# EAGLE design mainPCB (EAGLE 8.6.0)
POPULATE: Y

## Sheet 1 of 3: RPi/ADC
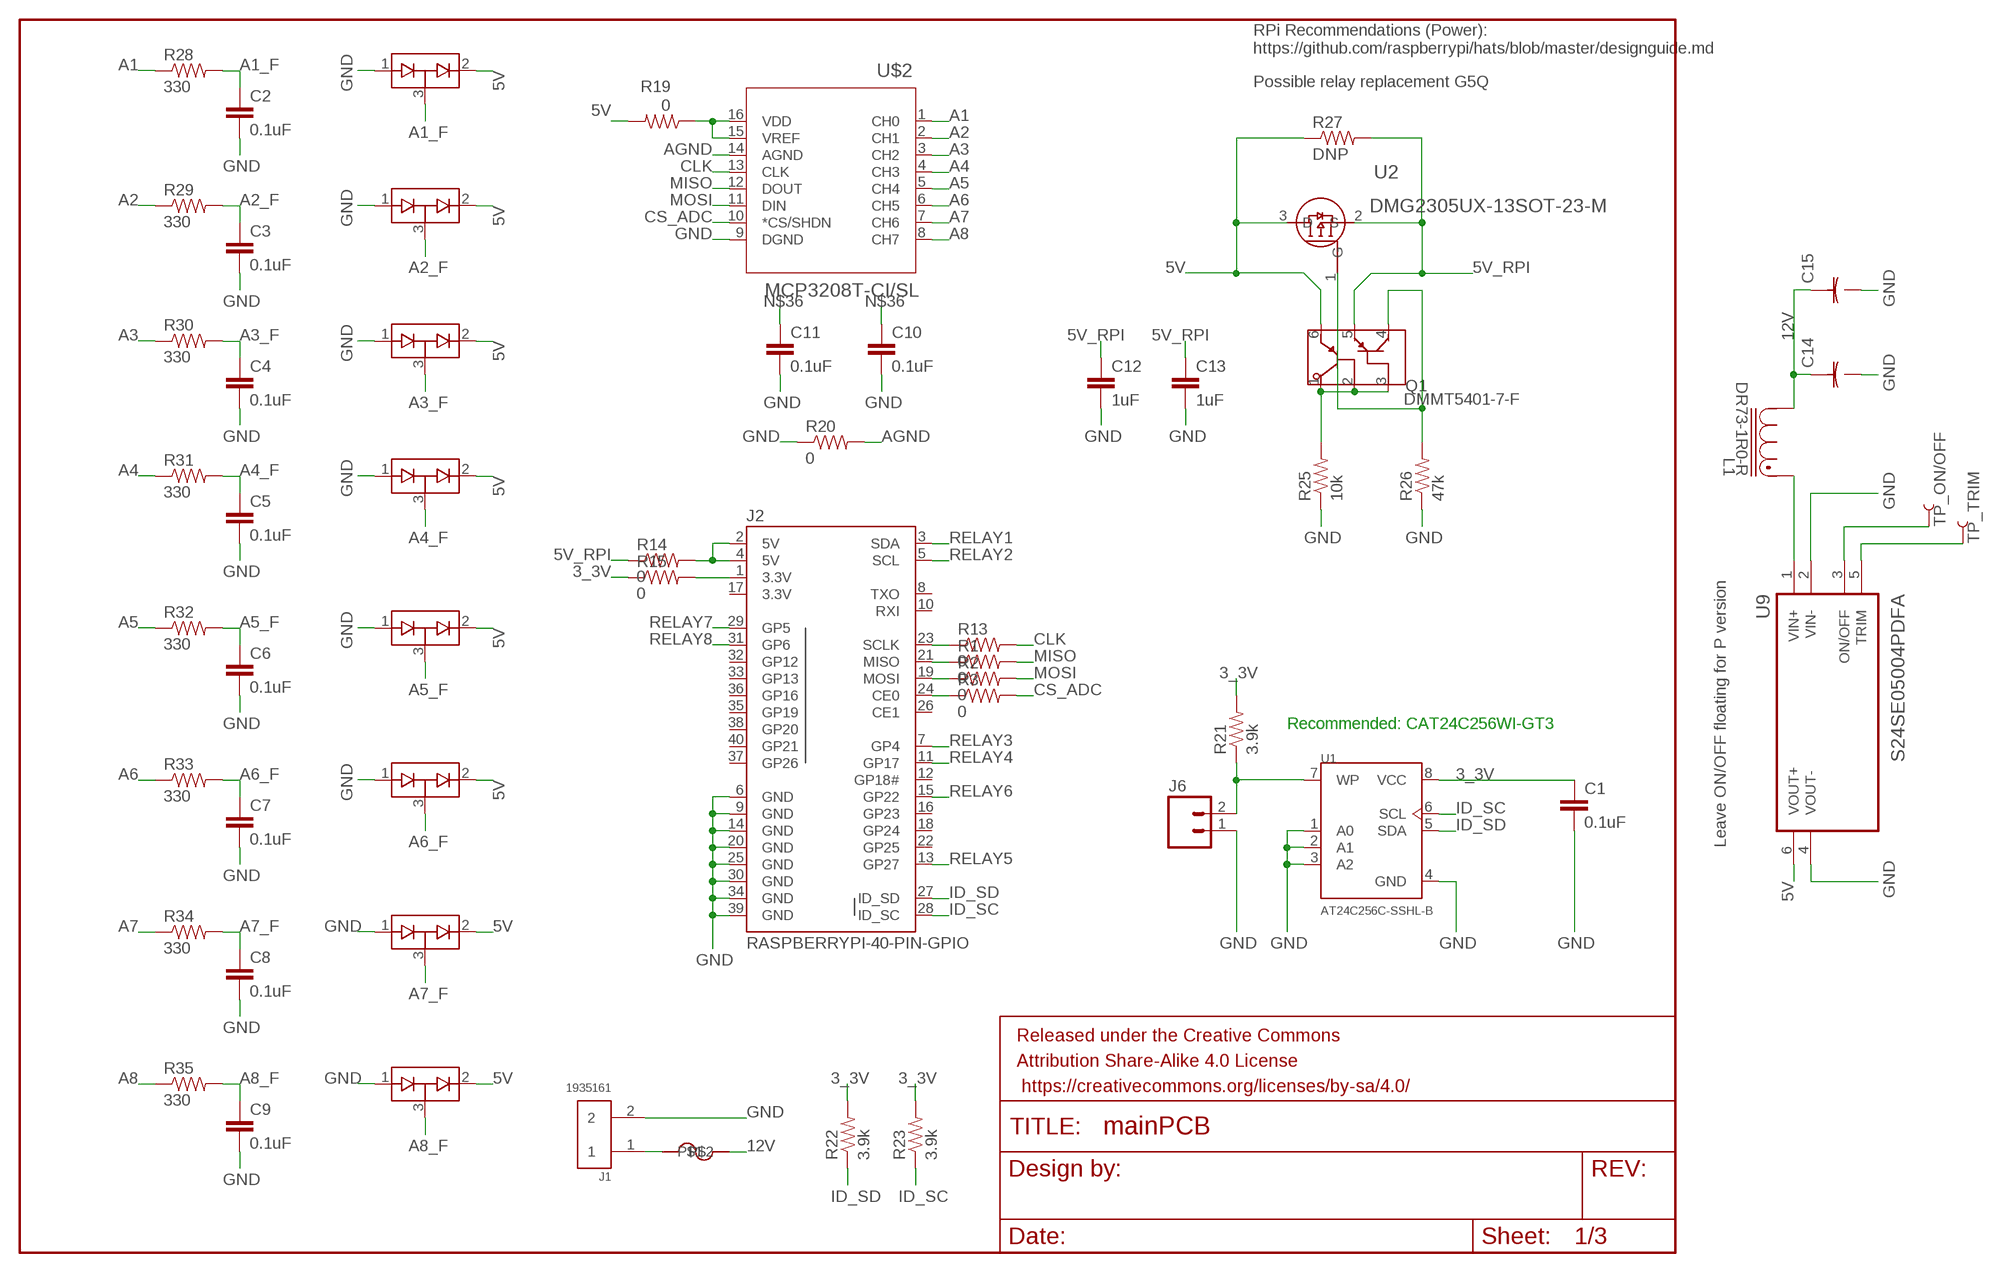
[diagram p0: schematic, sheet 1]

### Parts
C1  0.1uF  0.1UF-25V(+80/-20%)(0603)  [0603-CAP]
C2  0.1uF  0.1UF-25V(+80/-20%)(0603)  [0603-CAP]
C3  0.1uF  0.1UF-25V(+80/-20%)(0603)  [0603-CAP]
C4  0.1uF  0.1UF-25V(+80/-20%)(0603)  [0603-CAP]
C5  0.1uF  0.1UF-25V(+80/-20%)(0603)  [0603-CAP]
C6  0.1uF  0.1UF-25V(+80/-20%)(0603)  [0603-CAP]
C7  0.1uF  0.1UF-25V(+80/-20%)(0603)  [0603-CAP]
C8  0.1uF  0.1UF-25V(+80/-20%)(0603)  [0603-CAP]
C9  0.1uF  0.1UF-25V(+80/-20%)(0603)  [0603-CAP]
C10  0.1uF  0.1UF-25V(+80/-20%)(0603)  [0603-CAP]
C11  0.1uF  0.1UF-25V(+80/-20%)(0603)  [0603-CAP]
C12  1uF  1.0UF50V10%(1206)  [1206-CAP]
C13  1uF  1.0UF50V10%(1206)  [1206-CAP]
C14  EEE-HA1C471UPCAP_PAN_EEE_F-L  [CAP_PAN_EEE_F-L]
C15  EEE-HA1C471UPCAP_PAN_EEE_F-L  [CAP_PAN_EEE_F-L]
D1  BAV99-7-F  BAV99  [SOT23-3]
D5  BAV99-7-F  BAV99  [SOT23-3]
D7  BAV99-7-F  BAV99  [SOT23-3]
D12  BAV99-7-F  BAV99  [SOT23-3]
D13  BAV99-7-F  BAV99  [SOT23-3]
D14  BAV99-7-F  BAV99  [SOT23-3]
D15  BAV99-7-F  BAV99  [SOT23-3]
D16  BAV99-7-F  BAV99  [SOT23-3]
F9  3544-2  [3544-2]
FRAME2  FRAME-LETTERNO_PACKAGE  [DUMMY]
J1  1935161  [PHOENIX_1935161]
J2  RASPBERRYPI-40-PIN-GPIO  [2X20-SHROUDED]
J6  M02PTH  [1X02]
L1  DR73-1R0-R  [DR73]
Q1  DMMT5401-7-F  [SOT26]
R1  0  RESISTOR0603-RES  [0603-RES]
R2  0  RESISTOR0603-RES  [0603-RES]
R3  0  RESISTOR0603-RES  [0603-RES]
R13  0  RESISTOR0603-RES  [0603-RES]
R14  0  RESISTOR1206  [1206]
R15  0  RESISTOR1206  [1206]
R19  0  RESISTOR0603-RES  [0603-RES]
R20  0  RESISTOR0603-RES  [0603-RES]
R21  3.9k  RESISTOR0603-RES  [0603-RES]
R22  3.9k  RESISTOR0603-RES  [0603-RES]
R23  3.9k  RESISTOR0603-RES  [0603-RES]
R25  10k  RESISTOR0603-RES  [0603-RES]
R26  47k  RESISTOR0603-RES  [0603-RES]
R27  DNP  RESISTOR1206  [1206]
R28  330  RESISTOR0603-RES  [0603-RES]
R29  330  RESISTOR0603-RES  [0603-RES]
R30  330  RESISTOR0603-RES  [0603-RES]
R31  330  RESISTOR0603-RES  [0603-RES]
R32  330  RESISTOR0603-RES  [0603-RES]
R33  330  RESISTOR0603-RES  [0603-RES]
R34  330  RESISTOR0603-RES  [0603-RES]
R35  330  RESISTOR0603-RES  [0603-RES]
TP_ON/OFF  TEST-POINT3X5  [PAD.03X.05]
TP_TRIM  TEST-POINT3X5  [PAD.03X.05]
U1  AT24C256C-SSHL-B  [SOIC127P600X175-8N]
U2  DMG2305UX-13SOT-23-M  [SOT-23-M]
U9  S24SE05004PDFA  [CONV_S24SE05002PDFA]
U$2  MCP3208T-CI/SL  [SOIC16-N_MC]

### Nets
3_3V [powerMin]: C1.1 R15.1 R21.2 R22.2 R23.2 U1.8(VCC)
5V: D1.2(C2) D5.2(C2) D7.2(C2) D12.2(C2) D13.2(C2) D14.2(C2) D15.2(C2) D16.2(C2) Q1.6(E1) R19.2 R27.1 U2.3(D) U9.6(VOUT+) ; also sheet 2,3
5V_RPI: C12.1 C13.1 Q1.5(E2) R14.1 R27.2 U2.2(S)
12V: C14.1 C15.1 F9.P$3 F9.P$4 L1.2 ; also sheet 2,3
A1: R28.1 U$2.1(CH0)
A1_F: C2.1 D1.3(COM) R28.2 ; also sheet 2
A2: R29.1 U$2.2(CH1)
A2_F: C3.1 D5.3(COM) R29.2 ; also sheet 2
A3: R30.1 U$2.3(CH2)
A3_F: C4.1 D7.3(COM) R30.2 ; also sheet 2
A4: R31.1 U$2.4(CH3)
A4_F: C5.1 D12.3(COM) R31.2 ; also sheet 2
A5: R32.1 U$2.5(CH4)
A5_F: C6.1 D13.3(COM) R32.2 ; also sheet 3
A6: R33.1 U$2.6(CH5)
A6_F: C7.1 D14.3(COM) R33.2 ; also sheet 3
A7: R34.1 U$2.7(CH6)
A7_F: C8.1 D15.3(COM) R34.2 ; also sheet 3
A8: R35.1 U$2.8(CH7)
A8_F: C9.1 D16.3(COM) R35.2 ; also sheet 3
AGND [spi]: R20.2 U$2.14(AGND)
CLK [spi]: R13.2 U$2.13(CLK)
CS_ADC [spi]: R3.2 U$2.10(*CS/SHDN)
GND: C1.2 C2.2 C3.2 C4.2 C5.2 C6.2 C7.2 C8.2 C9.2 C10.2 C11.2 C12.2 C13.2 C14.2 C15.2 D1.1(A1) D5.1(A1) D7.1(A1) D12.1(A1) D13.1(A1) D14.1(A1) D15.1(A1) D16.1(A1) J1.2 J2.6(GND) J2.9(GND) J2.14(GND) J2.20(GND) J2.25(GND) J2.30(GND) J2.34(GND) J2.39(GND) J6.1 R20.1 R25.1 R26.1 U1.1(A0) U1.2(A1) U1.3(A2) U1.4(GND) U9.2(VIN-) U9.4(VOUT-) U$2.9(DGND) ; also sheet 2,3
ID_SC: J2.28(ID_SC) R23.1 U1.6(SCL)
ID_SD [spi]: J2.27(ID_SD) R22.1 U1.5(SDA)
MISO [spi]: R1.2 U$2.12(DOUT)
MOSI [spi]: R2.2 U$2.11(DIN)
N$17: J2.2(5V) J2.4(5V) R14.2
N$18 [power]: J2.1(3.3V) R15.2
N$19 [spi]: J2.23(SCLK) R13.1
N$20 [spi]: J2.21(MISO) R1.1
N$25 [spi]: J2.19(MOSI) R2.1
N$26 [spi]: J2.24(CE0) R3.1
N$27: Q1.1(C1) Q1.2(B1) Q1.3(B2) R25.2
N$29: Q1.4(C2) R26.2 U2.1(G)
N$30: TP_ON/OFF.P$1 U9.3(ON/OFF)
N$36 [spi]: C10.1 C11.1 R19.1 U$2.15(VREF) U$2.16(VDD)
N$52: L1.1 U9.1(VIN+)
N$53: TP_TRIM.P$1 U9.5(TRIM)
N$54: F9.P$1 F9.P$2 J1.1
RELAY1: J2.3(SDA) ; also sheet 2
RELAY2: J2.5(SCL) ; also sheet 2
RELAY3: J2.7(GP4) ; also sheet 2
RELAY4: J2.11(GP17) ; also sheet 2
RELAY5: J2.13(GP27) ; also sheet 3
RELAY6: J2.15(GP22) ; also sheet 3
RELAY7: J2.29(GP5) ; also sheet 3
RELAY8: J2.31(GP6) ; also sheet 3
WP: J6.2 R21.1 U1.7(WP)
Unconnected: J2.8(TXO) J2.10(RXI) J2.12(GP18#) J2.16(GP23) J2.18(GP24) J2.22(GP25) J2.26(CE1) J2.32(GP12) J2.33(GP13) J2.35(GP19) J2.36(GP16) J2.37(GP26) J2.38(GP20) J2.40(GP21)

### Notes on the sheet
- RPi Recommendations (Power):
  https://github.com/raspberrypi/hats/blob/master/designguide.md
- Possible relay replacement G5Q
- Recommended: CAT24C256WI-GT3
- Leave ON/OFF floating for P version

## Sheet 2 of 3: Relays 1-2
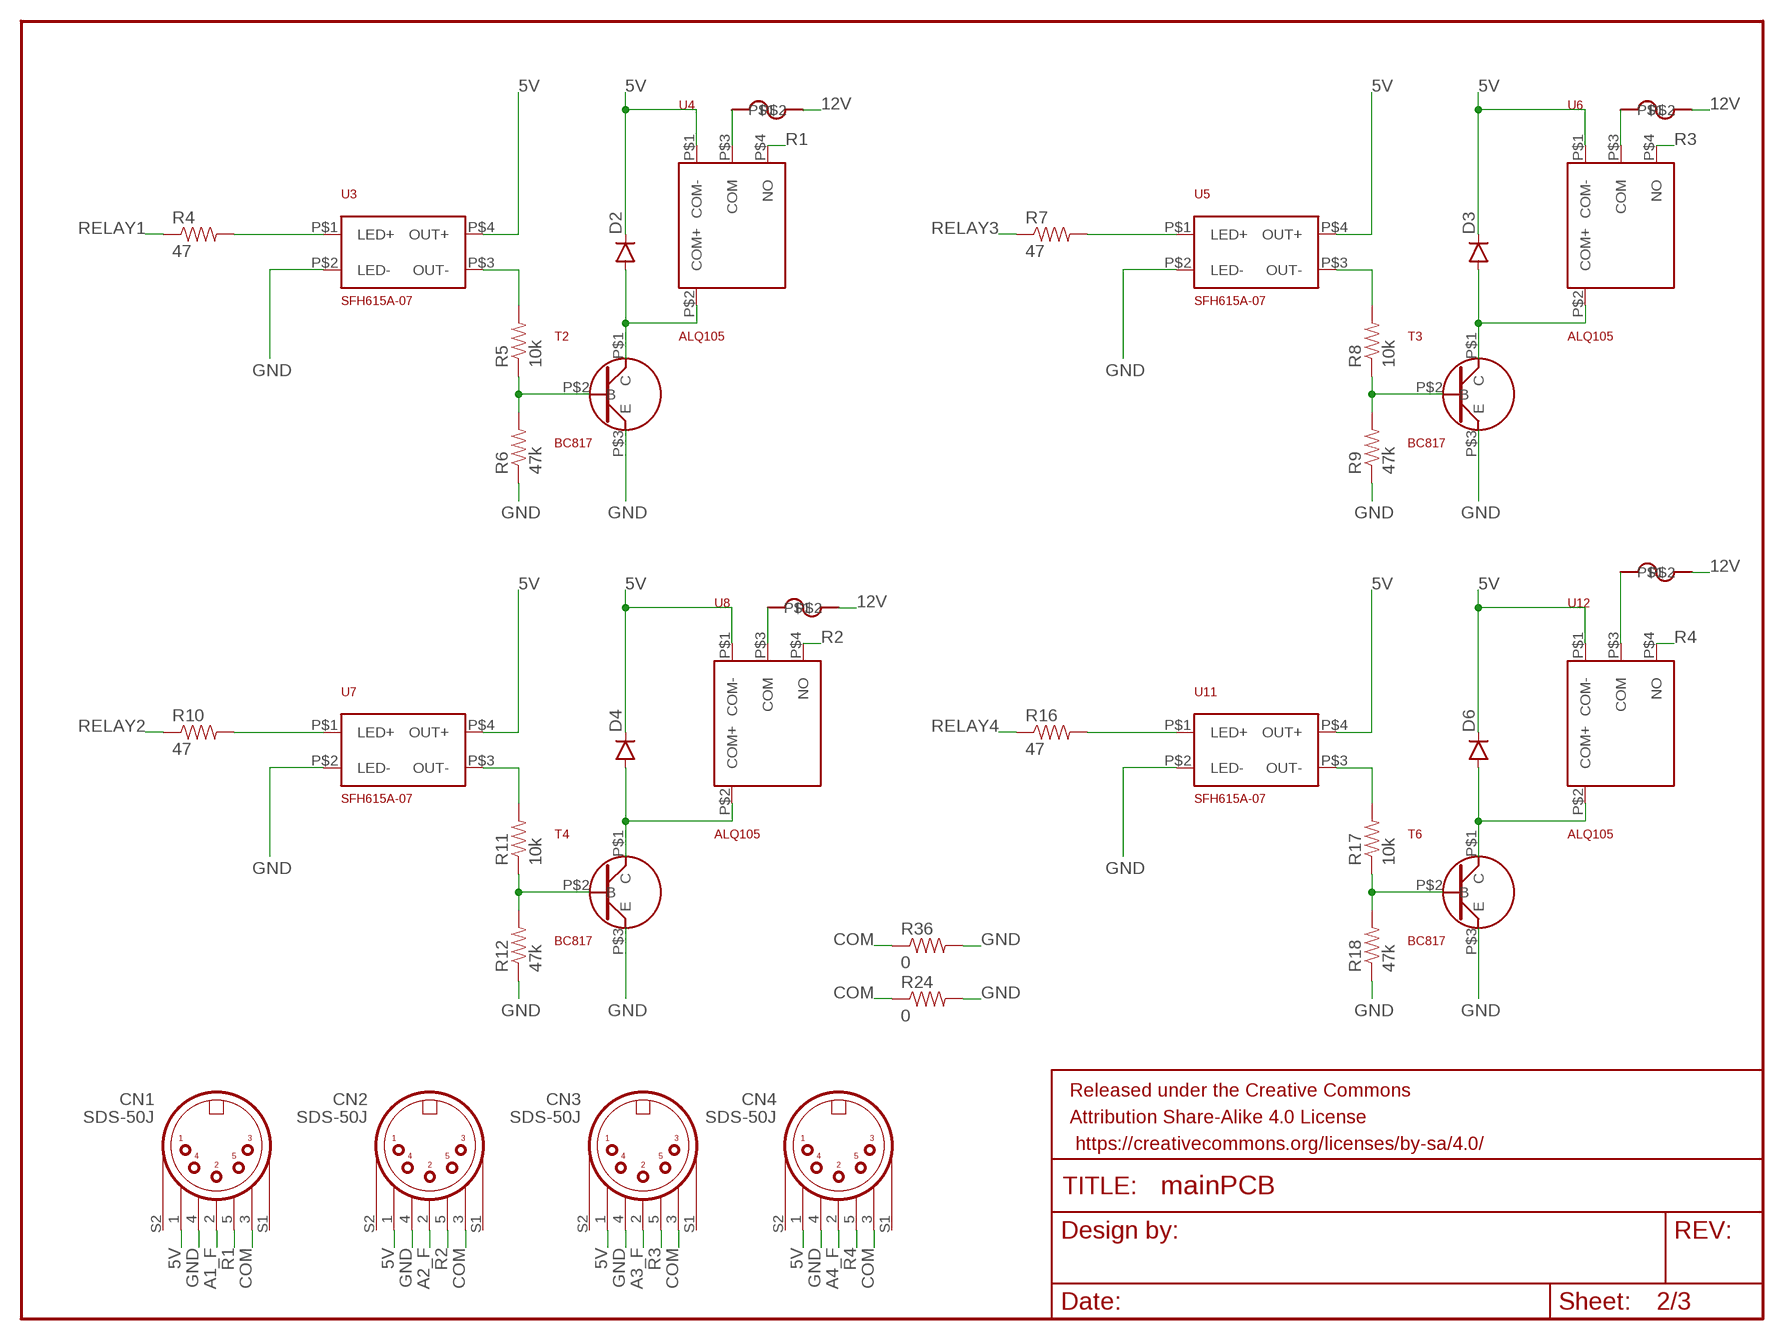
[diagram p1: schematic, sheet 2]

### Parts
CN1  SDS-50J  [SDS-50J]
CN2  SDS-50J  [SDS-50J]
CN3  SDS-50J  [SDS-50J]
CN4  SDS-50J  [SDS-50J]
D2  DIODESMA  [SMA-DIODE]
D3  DIODESMA  [SMA-DIODE]
D4  DIODESMA  [SMA-DIODE]
D6  DIODESMA  [SMA-DIODE]
F1  3544-2  [3544-2]
F2  3544-2  [3544-2]
F3  3544-2  [3544-2]
F4  3544-2  [3544-2]
FRAME1  FRAME-LETTERNO_PACKAGE  [DUMMY]
R4  47  RESISTOR0603-RES  [0603-RES]
R5  10k  RESISTOR0603-RES  [0603-RES]
R6  47k  RESISTOR0603-RES  [0603-RES]
R7  47  RESISTOR0603-RES  [0603-RES]
R8  10k  RESISTOR0603-RES  [0603-RES]
R9  47k  RESISTOR0603-RES  [0603-RES]
R10  47  RESISTOR0603-RES  [0603-RES]
R11  10k  RESISTOR0603-RES  [0603-RES]
R12  47k  RESISTOR0603-RES  [0603-RES]
R16  47  RESISTOR0603-RES  [0603-RES]
R17  10k  RESISTOR0603-RES  [0603-RES]
R18  47k  RESISTOR0603-RES  [0603-RES]
R24  0  RESISTOR1206  [1206]
R36  0  RESISTOR1206  [1206]
T2  BC817  [BC817]
T3  BC817  [BC817]
T4  BC817  [BC817]
T6  BC817  [BC817]
U3  SFH615A-07  [SFH615A-07]
U4  ALQ105  [ALQ105]
U5  SFH615A-07  [SFH615A-07]
U6  ALQ105  [ALQ105]
U7  SFH615A-07  [SFH615A-07]
U8  ALQ105  [ALQ105]
U11  SFH615A-07  [SFH615A-07]
U12  ALQ105  [ALQ105]

### Nets
5V: CN1.1 CN2.1 CN3.1 CN4.1 D2.C D3.C D4.C D6.C U3.P$4(OUT+) U4.P$1(COM-) U5.P$4(OUT+) U6.P$1(COM-) U7.P$4(OUT+) U8.P$1(COM-) U11.P$4(OUT+) U12.P$1(COM-) ; also sheet 1,3
12V: F1.P$3 F1.P$4 F2.P$3 F2.P$4 F3.P$3 F3.P$4 F4.P$3 F4.P$4 ; also sheet 1,3
A1_F: CN1.2 ; also sheet 1
A2_F: CN2.2 ; also sheet 1
A3_F: CN3.2 ; also sheet 1
A4_F: CN4.2 ; also sheet 1
COM: CN1.3 CN2.3 CN3.3 CN4.3 R24.1 R36.1 ; also sheet 3
GND: CN1.4 CN2.4 CN3.4 CN4.4 R6.1 R9.1 R12.1 R18.1 R24.2 R36.2 T2.P$3(E) T3.P$3(E) T4.P$3(E) T6.P$3(E) U3.P$2(LED-) U5.P$2(LED-) U7.P$2(LED-) U11.P$2(LED-) ; also sheet 1,3
N$1: F1.P$1 F1.P$2 U4.P$3(COM)
N$2: F2.P$1 F2.P$2 U8.P$3(COM)
N$3: F4.P$1 F4.P$2 U12.P$3(COM)
N$4: F3.P$1 F3.P$2 U6.P$3(COM)
N$5: R4.2 U3.P$1(LED+)
N$6: R5.2 U3.P$3(OUT-)
N$7: R5.1 R6.2 T2.P$2(B)
N$8: D2.A T2.P$1(C) U4.P$2(COM+)
N$9: R7.2 U5.P$1(LED+)
N$10: R8.2 U5.P$3(OUT-)
N$11: R8.1 R9.2 T3.P$2(B)
N$12: D3.A T3.P$1(C) U6.P$2(COM+)
N$13: R10.2 U7.P$1(LED+)
N$14: R11.2 U7.P$3(OUT-)
N$15: R11.1 R12.2 T4.P$2(B)
N$16: D4.A T4.P$1(C) U8.P$2(COM+)
N$21: R16.2 U11.P$1(LED+)
N$22: R17.2 U11.P$3(OUT-)
N$23: R17.1 R18.2 T6.P$2(B)
N$24: D6.A T6.P$1(C) U12.P$2(COM+)
R1: CN1.5 U4.P$4(NO)
R2: CN2.5 U8.P$4(NO)
R3: CN3.5 U6.P$4(NO)
R4: CN4.5 U12.P$4(NO)
RELAY1: R4.1 ; also sheet 1
RELAY2: R10.1 ; also sheet 1
RELAY3: R7.1 ; also sheet 1
RELAY4: R16.1 ; also sheet 1
Unconnected: CN1.S1 CN1.S2 CN2.S1 CN2.S2 CN3.S1 CN3.S2 CN4.S1 CN4.S2

## Sheet 3 of 3
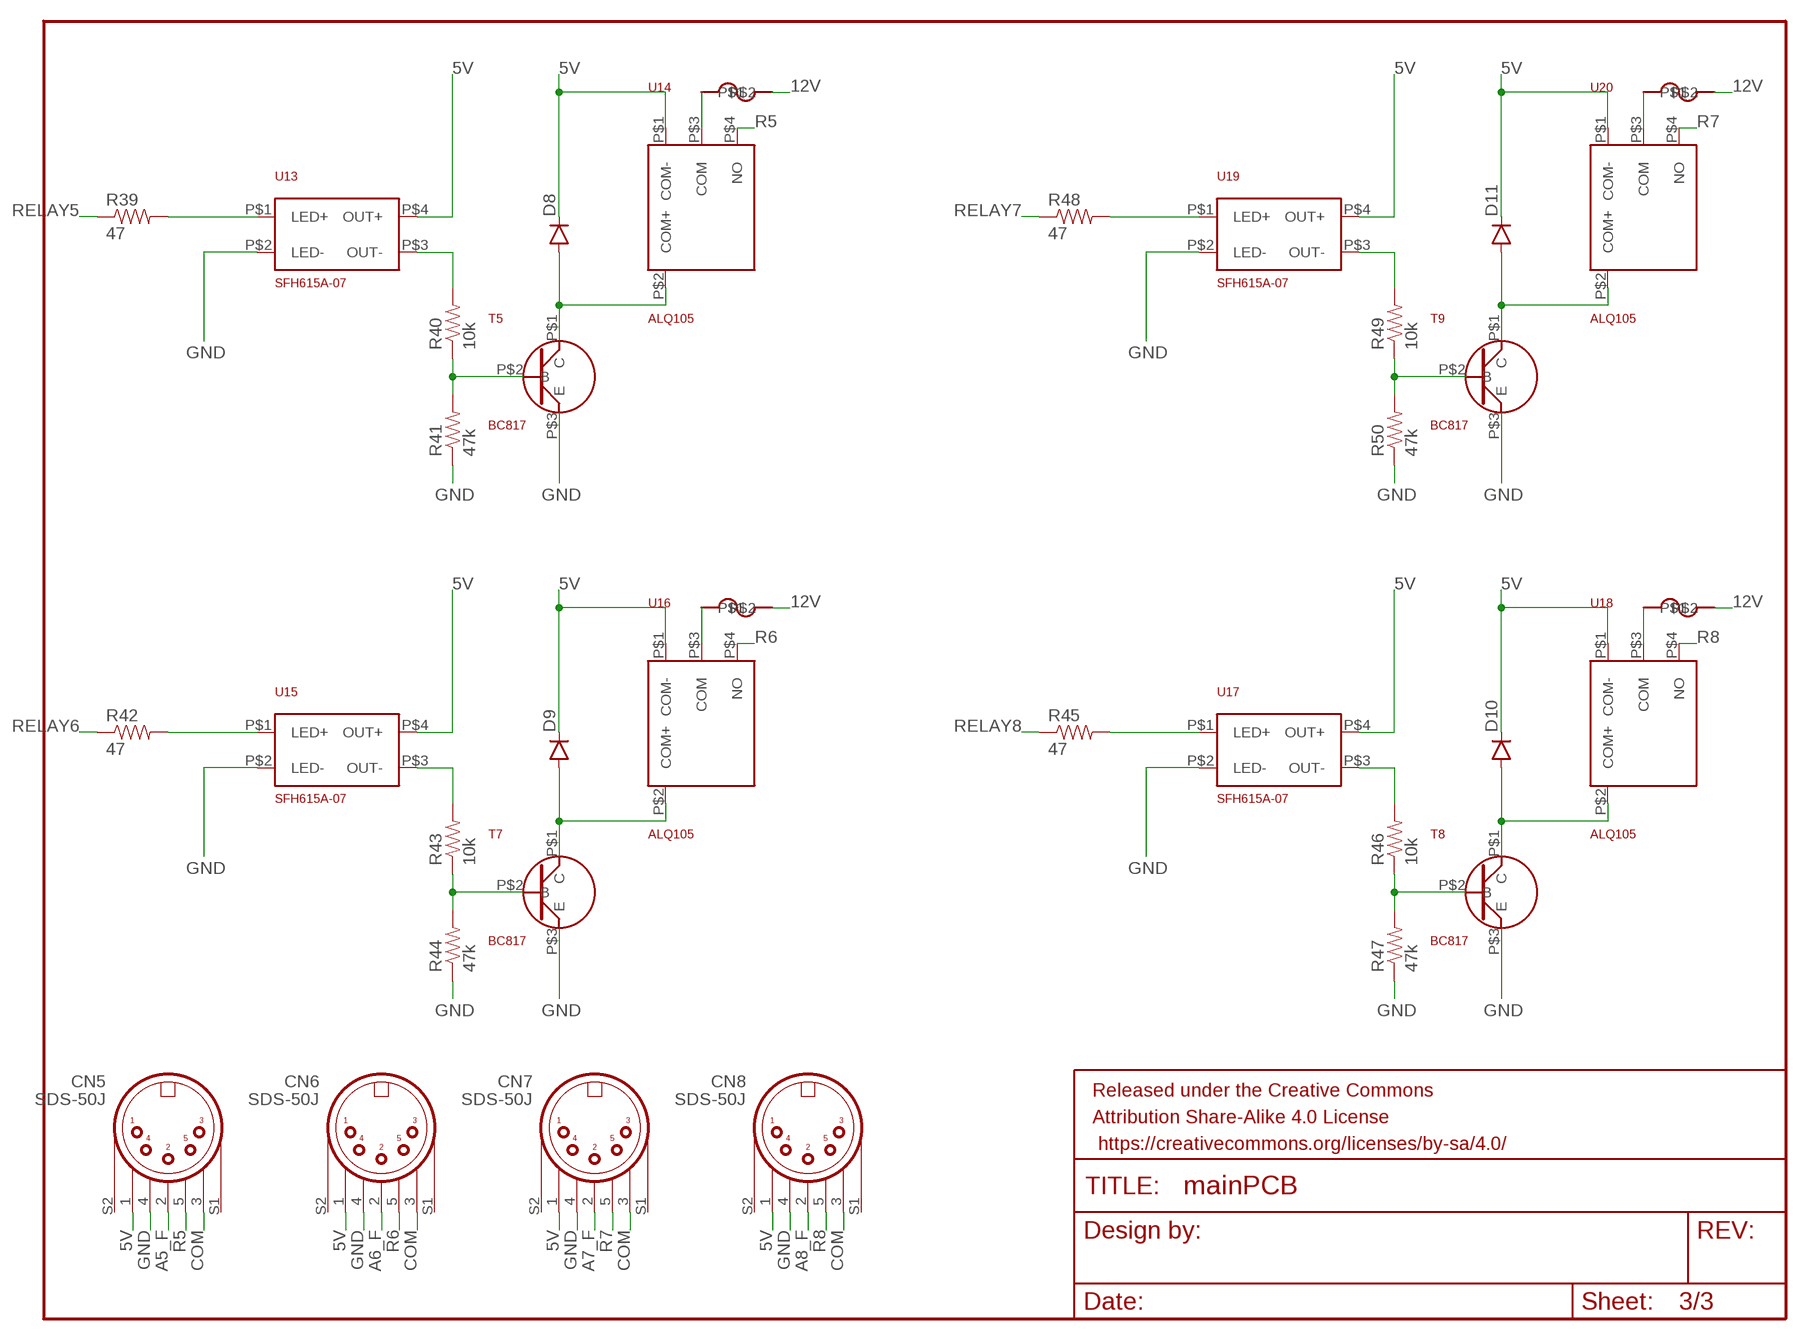
[diagram p2: schematic, sheet 3]

### Parts
CN5  SDS-50J  [SDS-50J]
CN6  SDS-50J  [SDS-50J]
CN7  SDS-50J  [SDS-50J]
CN8  SDS-50J  [SDS-50J]
D8  DIODESMA  [SMA-DIODE]
D9  DIODESMA  [SMA-DIODE]
D10  DIODESMA  [SMA-DIODE]
D11  DIODESMA  [SMA-DIODE]
F5  3544-2  [3544-2]
F6  3544-2  [3544-2]
F7  3544-2  [3544-2]
F8  3544-2  [3544-2]
FRAME3  FRAME-LETTER  [CREATIVE_COMMONS]
R39  47  RESISTOR0603-RES  [0603-RES]
R40  10k  RESISTOR0603-RES  [0603-RES]
R41  47k  RESISTOR0603-RES  [0603-RES]
R42  47  RESISTOR0603-RES  [0603-RES]
R43  10k  RESISTOR0603-RES  [0603-RES]
R44  47k  RESISTOR0603-RES  [0603-RES]
R45  47  RESISTOR0603-RES  [0603-RES]
R46  10k  RESISTOR0603-RES  [0603-RES]
R47  47k  RESISTOR0603-RES  [0603-RES]
R48  47  RESISTOR0603-RES  [0603-RES]
R49  10k  RESISTOR0603-RES  [0603-RES]
R50  47k  RESISTOR0603-RES  [0603-RES]
T5  BC817  [BC817]
T7  BC817  [BC817]
T8  BC817  [BC817]
T9  BC817  [BC817]
U13  SFH615A-07  [SFH615A-07]
U14  ALQ105  [ALQ105]
U15  SFH615A-07  [SFH615A-07]
U16  ALQ105  [ALQ105]
U17  SFH615A-07  [SFH615A-07]
U18  ALQ105  [ALQ105]
U19  SFH615A-07  [SFH615A-07]
U20  ALQ105  [ALQ105]

### Nets
5V: CN5.1 CN6.1 CN7.1 CN8.1 D8.C D9.C D10.C D11.C U13.P$4(OUT+) U14.P$1(COM-) U15.P$4(OUT+) U16.P$1(COM-) U17.P$4(OUT+) U18.P$1(COM-) U19.P$4(OUT+) U20.P$1(COM-) ; also sheet 1,2
12V: F5.P$3 F5.P$4 F6.P$3 F6.P$4 F7.P$3 F7.P$4 F8.P$3 F8.P$4 ; also sheet 1,2
A5_F: CN5.2 ; also sheet 1
A6_F: CN6.2 ; also sheet 1
A7_F: CN7.2 ; also sheet 1
A8_F: CN8.2 ; also sheet 1
COM: CN5.3 CN6.3 CN7.3 CN8.3 ; also sheet 2
GND: CN5.4 CN6.4 CN7.4 CN8.4 R41.1 R44.1 R47.1 R50.1 T5.P$3(E) T7.P$3(E) T8.P$3(E) T9.P$3(E) U13.P$2(LED-) U15.P$2(LED-) U17.P$2(LED-) U19.P$2(LED-) ; also sheet 1,2
N$31: F5.P$1 F5.P$2 U14.P$3(COM)
N$32: F6.P$1 F6.P$2 U16.P$3(COM)
N$33: F7.P$1 F7.P$2 U20.P$3(COM)
N$34: F8.P$1 F8.P$2 U18.P$3(COM)
N$35: R39.2 U13.P$1(LED+)
N$37: R40.2 U13.P$3(OUT-)
N$38: R40.1 R41.2 T5.P$2(B)
N$39: D8.A T5.P$1(C) U14.P$2(COM+)
N$40: R42.2 U15.P$1(LED+)
N$41: R43.2 U15.P$3(OUT-)
N$42: R43.1 R44.2 T7.P$2(B)
N$43: D9.A T7.P$1(C) U16.P$2(COM+)
N$44: R45.2 U17.P$1(LED+)
N$45: R46.2 U17.P$3(OUT-)
N$46: R46.1 R47.2 T8.P$2(B)
N$47: D10.A T8.P$1(C) U18.P$2(COM+)
N$48: R48.2 U19.P$1(LED+)
N$49: R49.2 U19.P$3(OUT-)
N$50: R49.1 R50.2 T9.P$2(B)
N$51: D11.A T9.P$1(C) U20.P$2(COM+)
R5: CN5.5 U14.P$4(NO)
R6: CN6.5 U16.P$4(NO)
R7: CN7.5 U20.P$4(NO)
R8: CN8.5 U18.P$4(NO)
RELAY5: R39.1 ; also sheet 1
RELAY6: R42.1 ; also sheet 1
RELAY7: R48.1 ; also sheet 1
RELAY8: R45.1 ; also sheet 1
Unconnected: CN5.S1 CN5.S2 CN6.S1 CN6.S2 CN7.S1 CN7.S2 CN8.S1 CN8.S2

## Power pins joined to a net without a drawn wire
3.3V: J2.17(3.3V)

## Library data of the parts
C1-C11 = SparkFun-Capacitors:0.1UF-25V(+80/-20%)(0603): CAP-00810 Ceramic Standard decoupling cap; POPULATE: Y; PROD_ID: CAP-00810
C12 C13 = SparkFun-Capacitors:1.0UF50V10%(1206): CAP-09822; POPULATE: Y; PROD_ID: CAP-09822; VALUE: 1.0uF
C14 C15 = EEE-HA1C471UP:EEE-HA1C471UP; MANUFACTURER_PART_NUMBER: EEEHA1C471UP; POPULATE: Y; VENDOR: PANASONIC
CN1-CN8 = SDS-50J:SDS-50J: DIN 5-Pin - Circular; AVAILABILITY: Good; DESCRIPTION: 5 Pin%2C Right-Angle Receptacle%2C 180%C2%B0; MF: CUI; MP: SDS-50J; PACKAGE: None; POPULATE: Y; PRICE: 0.77 USD
D1 D5 D7 D12-D16 = SparkFun-DiscreteSemi:BAV99: Two small signal silicon diodes connected anode to cathode. Connections to all three nodes available. DIO-10647; POPULATE: Y; PROD_ID: DIO-10647
D2-D4 D6 D8-D11 = SparkFun-DiscreteSemi:DIODE: Diode These are standard reverse protection diodes and small signal diodes. SMA package can handle up to about 1A. SOD-323 can handle about 200mA. What the SOD-323 package when ordering, there are some mfgs out there that are 5-pin packages.; POPULATE: Y
F1-F9 = lib:3544-2: Keystone Electronics Fuse Holder - 3544-2 Data sheet <http://new.keyelco.com/product.cfm/product_id/1376/stepAccess/2451455>; POPULATE: Y
FRAME1 FRAME2 = SparkFun-Aesthetics:FRAME-LETTER: Schematic Frame Standard 8.5x11 US Letter frame; DESIGNER: Nobody; POPULATE: N; VERSION: v01
FRAME3 = SparkFun-Aesthetics:FRAME-LETTER: Schematic Frame Standard 8.5x11 US Letter frame; POPULATE: N
J1 = 1935161:1935161: Conn Terminal Blocks 2 POS 5mm Solder ST Thru-Hole 16A; DESCRIPTION: TERM BLOCK PCB 2POS 5.0MM GREEN; DIGI-KEY_PART_NUMBER: 277-1667-ND; DIGI-KEY_PURCHASE_URL: https://www.digikey.com/product-detail/en/phoenix-contact/1935161/277-1667-ND/568614?WT.z_cid=ref_snapeda&utm_source=snapeda&utm_medium=aggregator&utm_campaign=buynow; MF: Phoenix Contact; MP: 1935161; PACKAGE: None
J2 = SparkFun-Boards:RASPBERRYPI-40-PIN-GPIO: Second Generation Raspberry Pi GPIO Header 2x20 pin connector, as found on B, B+, A+ models.; POPULATE: Y
J6 = SparkFun-Connectors:M02: Standard 2-pin 0.1" header. Use with - straight break away headers ( PRT-00116) - right angle break away headers (PRT-00553) - swiss pins (PRT-00743) - machine pins (PRT-00117) - female headers (PRT-00115) Molex polarized connector foot print use with: PRT-08233 with associated crimp pins and housings. 2.54_SCREWTERM for use with PRT-10571. 3.5mm Screw Terminal footprints for PRT-08084 5mm Screw Terminal footprints for use with PRT-08432; POPULATE: Y
L1 = DR73-1R0-R:DR73-1R0-R; MANUFACTURER_PART_NUMBER: DR731R0R; VENDOR: Cooper Bussmann
Q1 = DMMT5401-7-F:DMMT5401-7-F: http://octopart.com/dmmt5401-7-f-diodes+inc.-39560120; DESCRIPTION: DMMT5401 Series PNP 150 V 300 mW Small Signal Transistor SMT - SOT-26-6; DIGI-KEY_PART_NUMBER: DMMT5401-FDICT-ND; DIGI-KEY_PURCHASE_URL: https://www.digikey.com/product-detail/en/diodes-incorporated/DMMT5401-7-F/DMMT5401-FDICT-ND/717881?WT.z_cid=ref_snapeda; MF: Diodes Inc.; MP: DMMT5401-7-F; PACKAGE: SOT-23 Diodes Inc.; POPULATE: Y
R1-R26 R28-R36 R39-R50 = SparkFun-Passives:RESISTOR: Resistor Basic schematic elements and footprints for 0603, 1206, and PTH resistors.; POPULATE: Y
R27 = SparkFun-Passives:RESISTOR: Resistor Basic schematic elements and footprints for 0603, 1206, and PTH resistors.; POPULATE: N
T2-T9 = lib:BC817: NPN Transistor BC817 Data sheet <https://www.diodes.com/assets/Datasheets/ds30575.pdf>; POPULATE: Y
TP_ON/OFF TP_TRIM = SparkFun-Passives:TEST-POINT: Bare copper test points for troubleshooting or ICT
U1 = AT24C256C-SSHL-B:AT24C256C-SSHL-B: EEPROM Serial-2Wire 256K-bit 32K x 8 1.8V/2.5V/3.3V/5V 8-Pin SOIC Bulk; DESCRIPTION: EEPROM Serial-2Wire 256K-bit 32K x 8 1.8V/2.5V/3.3V/5V 8-Pin SOIC Bulk; DIGI-KEY_PART_NUMBER: AT24C256C-SSHL-B-ND; DIGI-KEY_PURCHASE_URL: https://www.digikey.com/product-detail/en/microchip-technology/AT24C256C-SSHL-B/AT24C256C-SSHL-B-ND/2271121?WT.z_cid=ref_snapeda; MF: Atmel; MP: AT24C256C-SSHL-B; PACKAGE: SOIC-8 Atmel; POPULATE: Y
U2 = DMG2359UX:DMG2305UX-13; MANUFACTURER_PART_NUMBER: DMG2305UX13; POPULATE: Y; VENDOR: Diodes Inc
U3 U5 U7 U11 U13 U15 U17 U19 = lib:SFH615A-07: Vishay Optocoupler SFH615A-007 Data sheet <http://www.vishay.com/docs/83433/sfh615a.pdf>; POPULATE: Y
U4 U6 U8 U12 U14 U16 U18 U20 = lib:ALQ105: ALQ105 Solenoid Data sheet <http://www3.panasonic.biz/ac/e_download/control/relay/power/catalog/mech_eng_lq.pdf>; POPULATE: Y
U9 = S24SE05004PDFA:S24SE05004PDFA: None; AVAILABILITY: Warning; DESCRIPTION: DC/DC CONVERTER 5V 4A 20W 6DIP; MF: Delta Electronics; MP: S24SE05004PDFA; PACKAGE: DIP-6 Delta; PRICE: 35.63 USD
U$2 = MCP3208T-CI_SL:MCP3208T-CI/SL: Microchip MCP3208 ADC Data sheet <http://ww1.microchip.com/downloads/en/DeviceDoc/21298c.pdf>; AVAILABILITY: Good; DESCRIPTION: 8 Channel SPI Serial Interface 2.7 V 12-Bit A/D Converter SMT - SOIC-16; MF: Microchip; MP: MCP3208T-CI/SL; PACKAGE: SOIC-16 Microchip; POPULATE: Y; PRICE: 3.04 USD

## Net classes
0 default: clearance 0.508 mm
1 spi: width 0.406 mm, clearance 0.152 mm
2 power: width 1.27 mm, clearance 0.254 mm
3 powerMin: width 0.762 mm

## Board
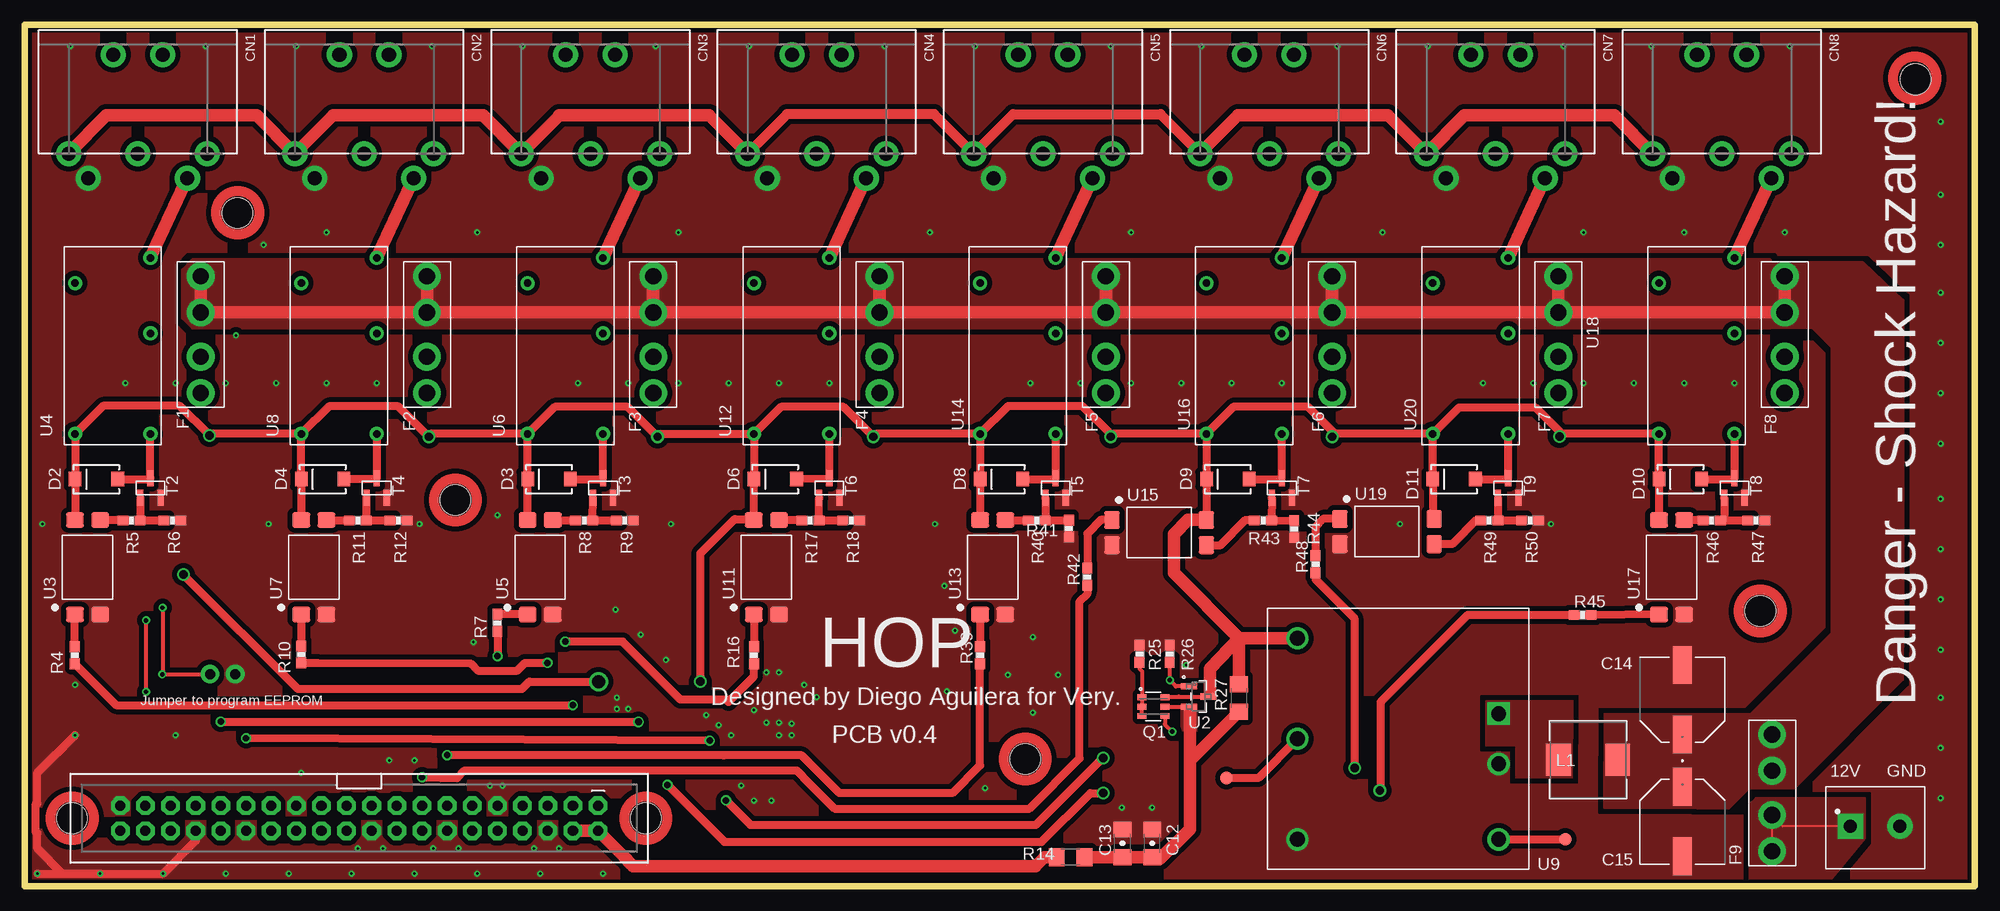
[diagram p3: board, top side]
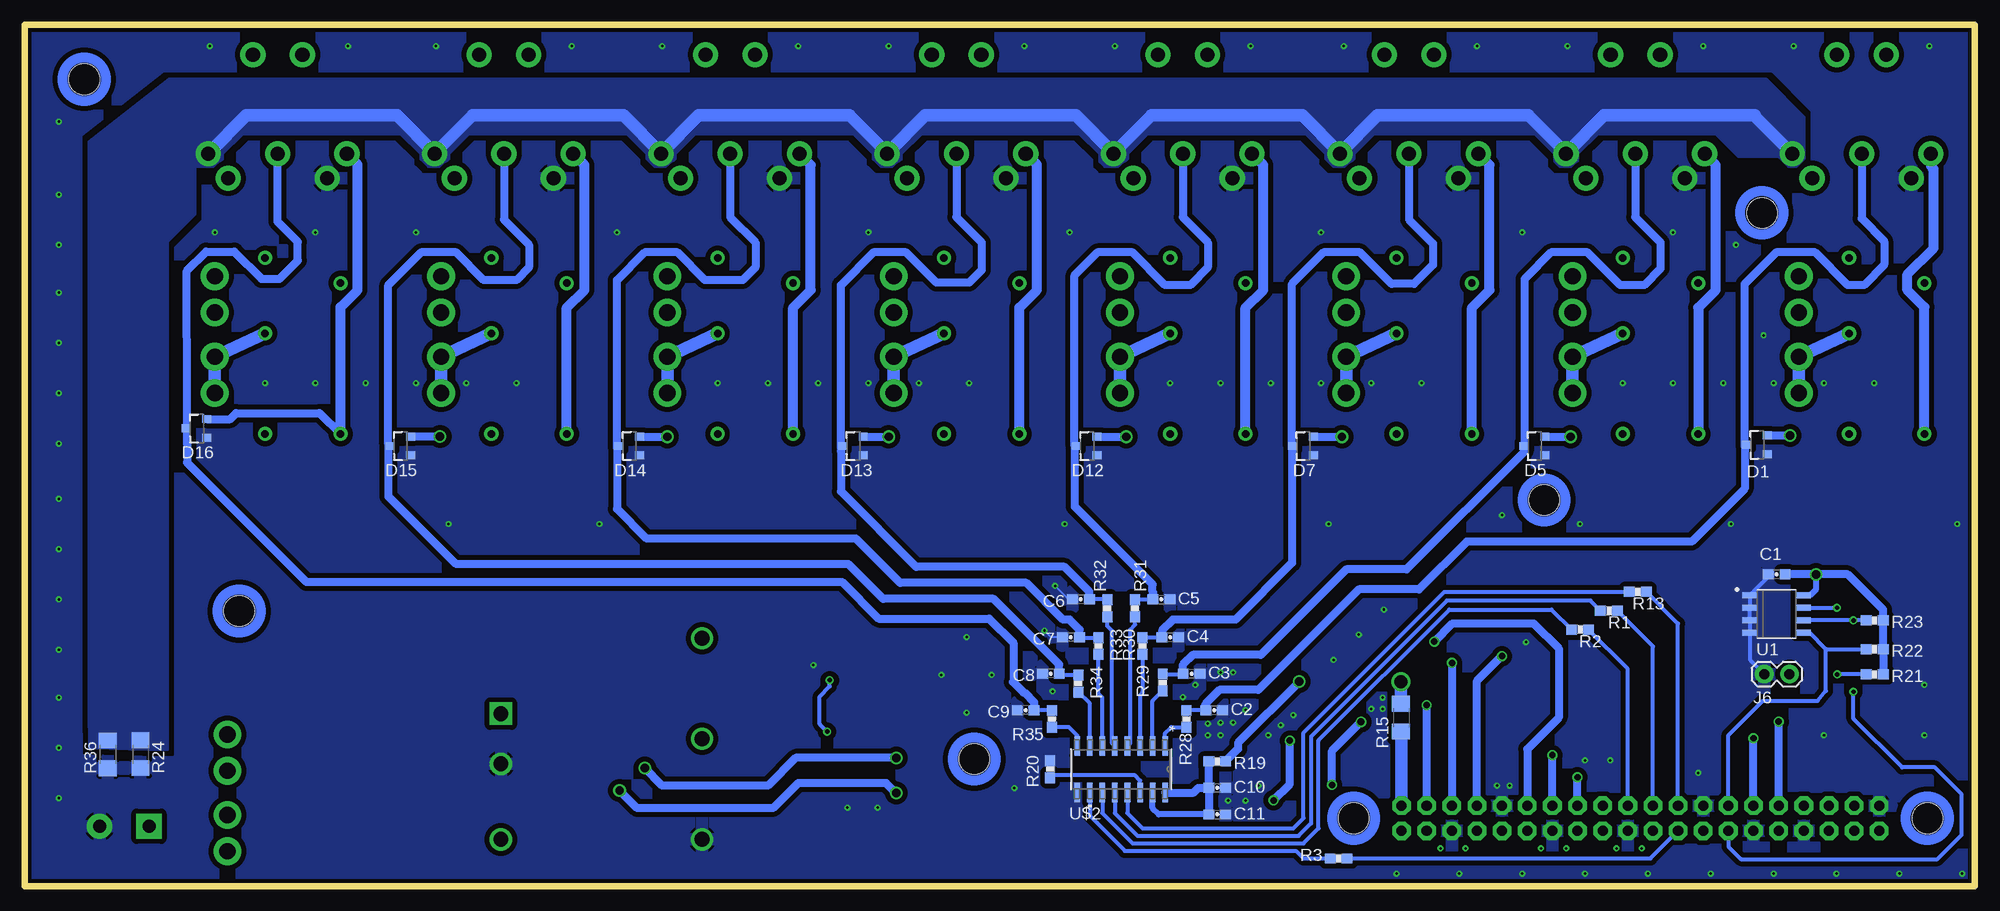
[diagram p4: board, bottom side, seen from below]

Size 197 x 87 mm. Coordinates in mm from the lower left corner, seen from the top.
Outline: 0,0 197,0 197,87 0,87 0,0
Copper layers (1*16): Top 0.0356mm / dielectric 1.5011mm / Bottom 0.0356mm
Design rules "oshpark-2layer *": minimum track width 6mil, minimum drill 13mil, track to track 6mil, track to pad 6mil, pad to pad 6mil, via to via 6mil, smd to smd 6mil, copper to edge 15mil, drill to drill 6mil, minimum pad ring 7mil, minimum via ring 7mil, stop-mask expansion 2.5mil, vias tented up to drill 0mil, thermal gap 10mil
Holes 3.1 mm at 4.78,6.86 62.74,6.86 21.5,68 191,81.5 101.07,12.83 43.5,39 175.33,27.78

### Footprints (pad centres in the part's own frame; a part is rotated, then mirrored left to right if it is on the bottom)
0603-CAP = smd 1.1 x 1: 1 -0.85,0; 2 0.85,0
1206-CAP = smd 1.6 x 1.8: 1 -1.4,0; 2 1.4,0
CAP_PAN_EEE_F-L = smd 3.81 x 1.905: 1 -3.505,0; 2 3.505,0
SDS-50J = drill 1.422 pad 2.54: 1 7,4.5; 2 0,4.5; 3 -7,4.5; 4 5,7; 5 -5,7; S1 -2.5,-5.5; S2 2.5,-5.5
SOT23-3 = smd 0.8 x 0.9: 1 -0.95,-1; 2 0.95,-1; 3 0,1.1
SMA-DIODE = smd 1.27 x 1.47: A -2.15,0; C 2.15,0
3544-2 = drill 1.65 pad 2.8: P$1 -5.895,0; P$2 -2.235,0; P$3 2.235,0; P$4 5.895,0
PHOENIX_1935161 = drill 1.3 pad 2.54 square: 1 -2.5,0 | drill 1.3 pad 2.54: 2 2.5,0
2X20-SHROUDED = drill 1.016 pad 1.88 octagon: 1 -1.27,24.13; 2 1.27,24.13; 3 -1.27,21.59; 4 1.27,21.59; 5 -1.27,19.05; 6 1.27,19.05; 7 -1.27,16.51; 8 1.27,16.51; 9 -1.27,13.97; 10 1.27,13.97; 11 -1.27,11.43; 12 1.27,11.43; 13 -1.27,8.89; 14 1.27,8.89; 15 -1.27,6.35; 16 1.27,6.35; 17 -1.27,3.81; 18 1.27,3.81; 19 -1.27,1.27; 20 1.27,1.27; 21 -1.27,-1.27; 22 1.27,-1.27; 23 -1.27,-3.81; 24 1.27,-3.81; 25 -1.27,-6.35; 26 1.27,-6.35; 27 -1.27,-8.89; 28 1.27,-8.89; 29 -1.27,-11.43; 30 1.27,-11.43; 31 -1.27,-13.97; 32 1.27,-13.97; 33 -1.27,-16.51; 34 1.27,-16.51; 35 -1.27,-19.05; 36 1.27,-19.05; 37 -1.27,-21.59; 38 1.27,-21.59; 39 -1.27,-24.13; 40 1.27,-24.13
1X02 = drill 1.016 pad 1.88: 1 0,0; 2 2.54,0
DR73 = smd 2.489 x 3.251: 1 -2.997,0; 2 2.997,0
SOT26 = smd 0.9 x 0.6: 1 -1.15,0.95; 2 -1.15,0; 3 -1.15,-0.95; 4 1.15,-0.95; 5 1.15,0; 6 1.15,0.95
0603-RES = smd 1.1 x 1: 1 -0.85,0; 2 0.85,0
1206 = smd 1.6 x 1.8: 1 -1.4,0; 2 1.4,0
BC817 = smd 0.612 x 1.626: P$1 0,0.996; P$2 -1.025,-0.996; P$3 1.025,-0.996
PAD.03X.05 = smd 1.27 x 1.27: P$1 0,0
SOIC127P600X175-8N = smd 1.55 x 0.6: 1 -2.7,1.905; 2 -2.7,0.635; 3 -2.7,-0.635; 4 -2.7,-1.905; 5 2.7,-1.905; 6 2.7,-0.635; 7 2.7,0.635; 8 2.7,1.905
SOT-23-M = smd 0.612 x 1.626: 1 -1.025,-0.996; 2 1.025,-0.996; 3 0,0.996
SFH615A-07 = smd 1.52 x 1.78: P$1 -4.765,1.27; P$2 -4.765,-1.27; P$3 4.765,-1.27; P$4 4.765,1.27
ALQ105 = drill 0.75 pad 1.422: P$1 -8.89,3.81; P$2 -8.89,-3.81; P$3 1.27,-3.81; P$4 8.89,-3.81; P$5 6.35,3.81
CONV_S24SE05002PDFA = drill 1.5 square: 1 -10.16,-2.54 | drill 1.5: 2 -10.16,2.54; 3 -10.16,10.16; 4 10.16,10.16; 5 10.16,0; 6 10.16,-10.16
SOIC16-N_MC = smd 1.981 x 0.559: 1 -2.362,4.445; 2 -2.362,3.175; 3 -2.362,1.905; 4 -2.362,0.635; 5 -2.362,-0.635; 6 -2.362,-1.905; 7 -2.362,-3.175; 8 -2.362,-4.445; 9 2.362,-4.445; 10 2.362,-3.175; 11 2.362,-1.905; 12 2.362,-0.635; 13 2.362,0.635; 14 2.362,1.905; 15 2.362,3.175; 16 2.362,4.445

### Placement (x,y rotation side)
C1  20.02,31.5 180 bottom
C2  76.83,17.78 0 bottom
C3  79.12,21.46 0 bottom
C4  81.28,25.15 0 bottom
C5  82.17,28.96 0 bottom
C6  90.3,28.96 180 bottom
C7  91.31,25.15 180 bottom
C8  93.34,21.46 180 bottom
C9  95.89,17.78 180 bottom
C10  76.53,9.93 0 bottom
C11  76.53,7.24 0 bottom
C12  113.89,4.32 90 top
C13  110.9,4.32 90 top
C14  167.46,18.82 90 top
C15  167.46,6.53 270 top
CN1  11.43,78.49 180 top
CN2  34.29,78.49 180 top
CN3  57.15,78.49 180 top
CN4  80.01,78.49 180 top
CN5  102.87,78.49 180 top
CN6  125.73,78.49 180 top
CN7  148.59,78.49 180 top
CN8  171.45,78.49 180 top
D1  21.97,44.58 90 bottom
D2  7.24,41.1 180 top
D3  52.96,41.1 180 top
D4  30.1,41.1 180 top
D5  44.45,44.45 90 bottom
D6  75.82,41.1 180 top
D7  67.82,44.45 90 bottom
D8  98.68,41.1 180 top
D9  121.54,41.1 180 top
D10  167.26,41.1 180 top
D11  144.4,41.1 180 top
D12  89.66,44.45 90 bottom
D13  113.28,44.45 90 bottom
D14  135.89,44.45 90 bottom
D15  159,44.45 90 bottom
D16  179.6,46.23 90 bottom
F1  17.78,55.7 90 top
F2  40.64,55.7 90 top
F3  63.5,55.7 90 top
F4  86.36,55.7 90 top
F5  109.22,55.7 90 top
F6  132.08,55.7 90 top
F7  154.94,55.7 90 top
F8  177.8,55.7 90 top
F9  176.53,9.42 90 top
FRAME1  165.74,3.12 0 top
FRAME2  171.07,3.12 0 top
FRAME3  176.28,3.12 0 top
J1  186.94,6.05 0 top
J2  33.78,6.86 270 top
J6  21.26,21.41 0 bottom
L1  157.94,12.75 0 top
Q1  114.02,18.14 0 top
R1  36.96,27.81 180 bottom
R2  39.88,25.91 180 bottom
R3  64.26,2.79 180 bottom
R4  5.05,23.32 90 top
R5  10.79,36.93 180 top
R6  14.91,36.93 180 top
R7  47.75,26.6 90 top
R8  56.52,36.93 180 top
R9  60.63,36.93 180 top
R10  27.94,23.4 90 top
R11  33.66,36.93 180 top
R12  37.77,36.93 180 top
R13  34.04,29.72 180 bottom
R14  105.66,2.92 180 top
R15  57.96,17.02 270 bottom
R16  73.66,23.32 90 top
R17  79.38,36.93 180 top
R18  83.49,36.93 180 top
R19  76.53,12.6 0 bottom
R20  93.42,11.81 270 bottom
R21  10.11,21.39 0 bottom
R22  10.11,23.93 0 bottom
R23  10.11,26.85 0 bottom
R24  185.32,13.34 270 bottom
R25  112.62,23.47 270 top
R26  115.67,23.47 270 top
R27  122.66,19 270 top
R28  79.63,16.89 90 bottom
R29  82.04,20.57 90 bottom
R30  84.07,24.26 90 bottom
R31  84.84,28.07 90 bottom
R32  87.63,28.07 90 bottom
R33  88.52,24.26 90 bottom
R34  90.55,20.45 90 bottom
R35  93.22,16.89 90 bottom
R36  188.62,13.31 270 bottom
R39  96.52,23.32 90 top
R40  102.23,36.93 180 top
R41  105.49,36.12 90 top
R42  107.34,31.24 90 top
R43  125.09,36.93 180 top
R44  128.24,36.07 90 top
R45  157.38,27.38 0 top
R46  170.43,36.93 180 top
R47  174.93,36.93 180 top
R48  130.41,32.51 90 top
R49  147.96,36.93 180 top
R50  152.07,36.93 180 top
T2  12.7,40.21 0 top
T3  58.42,40.21 0 top
T4  35.56,40.21 0 top
T5  104.14,40.21 0 top
T6  81.28,40.21 0 top
T7  127,40.21 0 top
T8  172.72,40.21 0 top
T9  149.86,40.21 0 top
TP_ON/OFF  155.65,4.72 0 top
TP_TRIM  121.41,10.92 0 top
U1  20.02,27.48 0 bottom
U2  118.59,19.15 270 top
U3  6.35,32.21 90 top
U4  8.89,54.56 90 top
U5  52.07,32.21 90 top
U6  54.61,54.56 90 top
U7  29.21,32.21 90 top
U8  31.75,54.56 90 top
U9  138.73,14.88 180 top
U11  74.93,32.21 90 top
U12  77.47,54.56 90 top
U13  97.79,32.21 90 top
U14  100.33,54.56 90 top
U15  114.61,35.71 0 top
U16  123.19,54.56 90 top
U17  166.37,32.21 90 top
U18  168.91,54.56 90 top
U19  137.62,35.82 0 top
U20  146.05,54.56 90 top
U$2  86.23,11.81 270 bottom

### Tracks (layer width: path | path; a pad name or v marks a point on that pad's centre or on a via)
3_3V  (via drill 0.85, 1.3)
  Top 0.813: v57.96,20.65 50.98,20.65 50.24,19.91 27.58,19.91 v16.03,31.47
  Bottom 0.61: U1.8 16.64,29.39 16.03,30 v16.03,31.47 16.05,31.5
  Bottom 0.813: R21.2 R22.2 R23.2 9.26,27.93 12.83,31.5 16.05,31.5 | 16.05,31.5 C1.1 | 16.05,31.5 v16.03,31.47
  Bottom 1.27: R15.1 v57.96,20.65
5V  (via drill 0.85)
  Top 0.406: Q1.6 115.24,19.15 116.59,19.15 U2.3 119.74,19.66
  Top 0.813: U3.P$4 D2.C U4.P$1 7.92,48.51 15.67,48.51 v18.67,45.52 18.82,45.67 U8.P$1 | U8.P$1 D4.C U7.P$4 | U6.P$1 D3.C U5.P$4 | U12.P$1 76.4,48.41 82.7,48.41 v85.72,45.39 86.01,45.67 U14.P$1 | U12.P$1 D6.C 73.66,37.06 | 73.66,37.06 U11.P$4 | U14.P$1 D8.C U13.P$4 | U16.P$1 D9.C 119.39,36.98 U15.P$4 | U20.P$1 D11.C 142.25,36.98 U19.P$4 | U17.P$4 D10.C U18.P$1 155.3,45.67 | v68.25,20.68 68.25,33.58 71.73,37.06 73.66,37.06 | U6.P$1 50.78,45.7 41.07,45.7 40.82,45.44 v40.82,45.39 37.74,48.46 30.73,48.46 U8.P$1 | U12.P$1 64.2,45.66 v63.93,45.39 60.91,48.41 53.54,48.41 U6.P$1 | U16.P$1 110.01,45.67 v109.73,45.39 109.73,45.62 106.83,48.51 99.36,48.51 U14.P$1 | U20.P$1 132.36,45.67 | 132.36,45.67 v132.08,45.39 | 155.3,45.67 v155.04,45.41 | U20.P$1 144.93,48.36 152.61,48.36 155.3,45.67 | U16.P$1 122.17,48.46 129.57,48.46 132.36,45.67
  Top 1.016: CN4.1 77,77.98 91.88,77.98 CN5.1 99.86,77.98 114.74,77.98 CN6.1
  Top 1.27: 4.45,74.04 8.26,77.85 23.43,77.85 CN2.1 31.16,77.85 46.28,77.85 CN3.1 53.98,77.81 53.98,77.85 69.14,77.85 CN4.1 | 119.36,74.66 122.56,77.85 137.72,77.85 CN7.1 145.46,77.85 160.59,77.85 CN8.1 | 119.74,19.66 119.74,21.95 122.68,25.04 | 122.68,25.04 U9.6 | R27.1 122.66,25.02 122.68,25.04 | 122.68,25.04 116.08,31.65 116.08,35.56 117.5,36.98 U15.P$4
  Bottom 0.813: v68.25,20.68 68.25,20.65 74.42,14.48 74.42,13.86 R19.2 | D15.2 157.99,45.41 v155.04,45.41 | D14.2 v132.09,45.4 v132.08,45.39 | D13.2 v109.74,45.4 v109.73,45.39 | D12.2 85.73,45.4 v85.72,45.39 | D7.2 63.94,45.4 v63.93,45.39 | D5.2 v40.83,45.4 v40.82,45.39 | D1.2 v18.68,45.53 v18.67,45.52 | D16.2 176.24,47.18 175.64,47.78 167.21,47.78 U18.P$1
  Bottom 1.016: U4.P$1 5.08,58.47 6.81,60.2 6.81,61.78 4.14,64.44 4.14,72.43 4.43,72.72 CN1.1 | U8.P$1 27.94,58.42 26.16,60.2 26.16,72.86 CN2.1 | U6.P$1 50.8,58.42 49.02,60.2 49.02,72.86 CN3.1 | U12.P$1 73.66,58.42 71.88,60.2 71.88,72.86 CN4.1 | U14.P$1 96.52,58.42 94.74,60.2 94.74,72.9 95.83,73.99 CN5.1 | U16.P$1 119.38,58.42 117.6,60.2 117.6,72.86 CN6.1 | U20.P$1 142.24,58.42 140.46,60.2 140.46,72.86 CN7.1 | U18.P$1 165.1,58.47 163.37,60.2 163.37,72.91 CN8.1
  pour Top (no thermals): 119.13,19.96 119.13,19 120.35,19 120.35,19.96
5V_RPI
  Top 0.406: 117.59,18.14 U2.2 | Q1.5 117.59,18.14 | 117.7,17.68 117.45,18 117.59,18.14
  Top 0.813: 111.3,2.92 111.31,2.92 111.76,2.92 | C12.1 113.03,2.92
  Top 1.27: 122.78,17.47 R27.2 117.7,12.65 | 117.7,17.68 117.7,12.65 | 117.7,12.65 117.7,5.74 114.71,2.74 114.53,2.92 113.03,2.92 111.76,2.92 C13.1 R14.1
  pour Top (no thermals): 116.81,15.65 116.81,18.44 118.41,18.44 118.41,15.6
12V
  Top 1.27: F2.P$3 F1.P$3 F1.P$4 | F2.P$3 F3.P$3 | F3.P$3 F4.P$3 | F4.P$3 F5.P$3 | F5.P$3 F6.P$3 | F6.P$3 F7.P$3 | F7.P$3 F8.P$3 F8.P$4 | F7.P$3 F7.P$4 | F6.P$3 F6.P$4 | F5.P$3 F5.P$4 | F4.P$3 F4.P$4 | F2.P$3 F2.P$4 | F3.P$3 F3.P$4
  pour Top (no thermals): 189.74,59.18 189.74,24.13 187.71,22.1 184.66,22.1 182.63,24.13 182.63,54.36 180.59,56.39 176.28,56.39 176.28,62.99 185.67,62.99
  pour Top (no thermals): 176.02,56.39 17.02,56.39 16,57.4 16,62.23 17.02,63.25 53.85,63.25 74.17,63.25 176.28,63.25 176.28,56.39
  pour Top (no thermals): 159.56,17.37 159.51,7.92 168.91,7.87 172.21,7.87 174.24,9.91 178.82,9.91 178.92,17.37
  pour Top (no thermals): 174.5,17.53 182.63,25.65 189.74,25.65 189.74,20.83 178.82,9.91 174.75,9.91 174.5,9.91
A1
  Bottom 0.406: U$2.1 81.79,15.44 81.18,16.05 79.64,16.05 R28.1
A1_F
  Bottom 0.406: 77.7,17.76 77.72,17.74 R28.2
  Bottom 0.813: CN1.2 11.43,67.44 9.14,65.15 9.14,62.74 11.18,60.71 12.83,60.71 16.13,64.01 20.07,64.01 23.24,60.83 23.24,44.45 | C2.1 77.7,17.76 77.7,18.41 76.3,19.81 72.39,19.81 62.23,29.97 56.13,29.97 51.31,34.8 28.6,34.8 23.24,40.16 23.24,44.45 | D1.3 23.2,44.45 23.24,44.45
A2
  Bottom 0.406: U$2.2 83.06,18.71 R29.1
A2_F
  Bottom 0.406: R29.2 80.01,21.42 C3.1
  Bottom 0.813: CN2.2 34.29,67.56 31.75,65.02 31.75,62.36 33.4,60.71 35.81,60.71 39.12,64.01 42.8,64.01 45.47,61.34 45.47,44.45 | C3.1 79.97,22.39 78.99,23.37 72.14,23.37 63.5,32 57.4,32 45.47,43.94 45.47,44.45 | D5.3 45.47,44.45
A3
  Bottom 0.406: R30.1 84.07,19.56 84.33,19.3 U$2.3
A3_F
  Bottom 0.406: C4.1 82.17,25.11 R30.2
  Bottom 0.813: CN3.2 57.15,67.31 54.74,64.9 54.74,62.74 56.64,60.83 58.93,60.83 62.1,64.01 65.79,64.01 68.96,60.83 68.96,44.45 | C4.1 82.04,25.23 82.04,25.91 81.03,26.92 74.68,26.92 68.96,32.64 68.96,44.45 | D7.3 68.96,44.45
A4
  Bottom 0.406: U$2.4 85.32,14.45 85.32,25.92 84.84,26.4 R31.1
A4_F
  Bottom 0.406: C5.1 84.8,28.96 R31.2
  Bottom 0.813: CN4.2 80.01,67.56 77.47,65.02 77.47,62.48 79.25,60.71 81.79,60.71 85.09,64.01 88.65,64.01 90.93,61.72 90.93,44.45 | C5.1 83.02,29.68 83.06,29.72 83.06,30.48 90.93,38.35 90.93,44.45 | D12.3 90.93,44.45
A5
  Bottom 0.406: U$2.5 87.15,14.45 87.15,25.79 87.63,26.27 R32.1
A5_F
  Bottom 0.406: C6.1 87.67,28.96 R32.2
  Bottom 0.813: CN5.2 102.87,67.56 100.33,65.02 100.33,62.23 101.6,60.96 104.9,60.96 107.95,64.01 111.25,64.01 114.55,60.71 114.55,44.28 | C6.1 89.45,29.76 91.95,32.26 106.93,32.26 114.55,39.88 114.55,43.94 114.55,44.28 | D13.3 114.55,44.28
A6
  Bottom 0.406: U$2.6 88.14,19.05 88.52,19.43 R33.1
A6_F
  Bottom 0.406: C7.1 90.42,25.11 R33.2
  Bottom 0.813: CN6.2 125.73,67.56 123.19,65.02 123.19,62.48 124.46,61.21 128.27,61.21 131.06,64.01 134.37,64.01 137.16,61.21 137.16,44.28 | C7.1 90.42,25.18 90.42,25.91 91.44,26.92 92.1,26.92 95.81,30.63 108.56,30.63 113.03,35.1 134.16,35.1 137.16,38.1 137.16,44.28 | D14.3 137.16,44.28
A7
  Bottom 0.406: U$2.7 89.41,18.45 R34.1
A7_F
  Bottom 0.406: R34.2 92.33,21.3 C8.1
  Bottom 0.813: CN7.2 148.59,67.31 146.05,64.77 146.05,62.48 147.32,61.21 150.62,61.21 153.42,64.01 156.97,64.01 160.27,60.71 160.27,44.62 | C8.1 92.5,22.39 99.11,29.01 110.29,29.01 113.79,32.51 153.42,32.51 160.27,39.37 160.27,44.62 | D15.3 160.27,44.62
A8
  Bottom 0.406: U$2.8 90.68,15.21 91.52,16.05 93.21,16.05 R35.1
A8_F
  Bottom 0.406: R35.2 95,17.74 C9.1 | D16.3 180.6,44.7
  Bottom 0.813: C9.1 95,17.82 95,18.54 96.01,19.56 96.11,19.56 97.18,20.62 97.13,20.68 97.13,24.59 99.57,27.03 110.74,27.03 114.45,30.73 168.55,30.73 180.6,42.78 180.6,44.7 180.59,47.25 180.59,48.51 180.62,62.15 178.69,64.08 175.82,64.08 173.08,61.34 171.25,61.34 169.42,63.17 169.42,65.08 171.45,67.11 CN8.2 | D16.3
AGND
  Bottom 0.406: U$2.14 84.33,10.67 84.84,11.18 93.21,11.18 R20.2
CLK
  Bottom 0.406: U$2.13 85.6,7.37 84.07,5.84 68.83,5.84 67.82,6.86 67.82,15.49 53.59,29.72 R13.2
COM
  Bottom 1.27: 41.27,74.04 37.47,77.85 22.23,77.85 22.23,77.78 CN1.3 | 41.27,74.04 45.09,77.85 60.33,77.85 64.14,74.04 | 41.27,74.04 CN2.3 | 64.14,74.04 67.94,77.85 83.19,77.85 87,74.04 | 64.14,74.04 CN3.3 | 87,74.04 90.81,77.85 106.05,77.85 109.86,74.04 | 87,74.04 CN4.3 | 109.86,74.04 113.67,77.85 128.91,77.85 132.72,74.04 | 109.86,74.04 CN5.3 | 132.72,74.04 136.53,77.85 151.76,77.85 155.57,74.04 | 132.72,74.04 CN6.3 | 155.57,74.04 159.38,77.85 174.62,77.85 178.44,74.04 CN8.3 | 155.57,74.04 CN7.3
  pour Bottom (no thermals): 181.36,81.53 21.08,81.53 17.27,77.72 17.27,73.41 18.03,72.64 18.8,72.64 19.81,73.66 23.88,73.66 26.16,75.95 38.1,75.95 40.13,73.91 40.13,73.15 40.64,72.64 41.91,72.64 42.42,73.15 42.42,73.91 44.45,75.95 60.71,75.95 62.74,73.91 62.74,73.41 63.5,72.64 64.77,72.64 65.53,73.41 65.53,73.91 67.56,75.95 83.57,75.95 85.6,73.91 85.6,73.41 86.36,72.64 87.88,72.64 88.39,73.15 88.39,73.91 90.42,75.95 106.43,75.95 108.46,73.91 108.46,73.41 109.22,72.64 110.49,72.64 111.25,73.41 111.25,73.91 113.28,75.95 129.29,75.95 131.32,73.91 131.32,73.41 132.08,72.64 133.35,72.64 134.11,73.41 134.11,73.91 136.14,75.95 152.15,75.95 154.18,73.91 154.18,73.41 154.94,72.64 156.21,72.64 156.97,73.41 156.97,73.91 159,75.95 175.01,75.95 177.04,73.91 177.04,73.41 177.8,72.64 190.5,72.64 190.5,74.17 188.72,75.69
  pour Bottom (no thermals): 182.63,13.72 190.45,13.92 190.5,17.98 190.5,75.18 182.37,81.53 179.83,81.53 179.83,67.82 182.63,65.02
CS_ADC
  Bottom 0.406: R3.2 67.82,2.79 68.58,3.56 85.85,3.56 89.41,7.11 U$2.10
GND  (via drill 0.25)
  Top 0.813: v5.08,15.24 1.27,11.43 1.27,8.37 1.12,8.34 1.12,5.38 1.27,5.35 1.27,3.81 3.81,1.27 v7.62,1.27 | v7.62,1.27 v13.97,1.27 17.27,4.57 J2.34 | v1.27,1.27 v7.62,1.27
  Bottom 0.203: v93.98,25.81 93.32,25.15 C7.2 | C6.2 91.54,28.96 v92.91,30.33
  Bottom 0.406: C1.2 20.86,31.24 U1.1 U1.2 U1.3 U1.4 22.71,22.87 J6.1
  other vias: 157.48,66.04 137.16,66.04 111.76,66.04 91.44,66.04 45.72,66.04 66.04,66.04 5.08,20.32 15.24,15.24 193.55,19.05 193.55,13.97 193.55,8.89 72.39,10.16 73.66,8.64 75.44,8.64 59.69,27.94 62.23,25.4 64.77,22.86 27.94,11.43 36.83,12.7 39.37,12.7 46.99,10.16 48.26,10.16 59.82,19.05 59.82,17.91 60.96,17.91 68.83,17.27 70.1,16.26 71.37,15.24 73.66,17.78 74.93,16.51 76.2,16.51 77.47,16.41 76.2,15.24 77.47,15.24 80.01,19.1 78.74,20.32 76.2,21.59 74.93,21.59 58.42,1.27 52.07,1.27 45.72,1.27 39.37,1.27 33.02,1.27 26.67,1.27 20.32,1.27 43.81,3.81 41.27,3.81 36.2,3.81 33.66,3.81 51.44,3.81 53.98,3.81 117.32,22.33 45.34,24.64 47.75,37.47 99.31,21.34 101.85,25.15 104.39,21.34 101.85,17.53 24.13,64.77 21.34,55.63 193.55,39.12 193.55,34.04 193.55,28.96 193.55,23.88 193.55,59.94 193.55,54.86 193.55,49.78 193.55,44.7 193.55,77.22 193.55,69.85 193.55,64.77 178.31,84.84 164.34,84.84 155.45,84.84 132.59,84.84 141.73,84.84 118.87,84.84 109.73,84.84 96.01,84.84 86.87,84.84 73.15,84.84 63.75,84.84 50.29,84.84 41.15,84.84 27.43,84.84 18.29,84.84 4.57,84.84 154.18,36.58 138.94,36.58 91.95,36.58 65.28,36.58 39.88,36.58 24.64,36.58 1.78,36.58 30.48,66.04 10.16,50.8 20.32,50.8 30.48,50.8 35.56,50.8 25.4,50.8 15.24,50.8 55.88,50.8 60.96,50.8 66.04,50.8 71.12,50.8 76.2,50.8 81.28,50.8 101.6,50.8 106.68,50.8 111.76,50.8 116.84,50.8 121.92,50.8 127,50.8 147.32,50.8 152.4,50.8 157.48,50.8 162.56,50.8 167.64,50.8 172.72,50.8 167.64,66.04 177.8,66.04 93.17,19.66 110.85,7.92 113.89,7.92 97.03,9.91
  pour Top (isolate 0.254, rank 3, no thermals): 0.91,85.6 0.91,0.91 196.03,0.66 196.03,85.6
  pour Bottom (rank 3): 0.61,87.02 196.03,87.02 196.03,0.41 0.71,0.41 0.71,87 0.69,87
ID_SC  (via drill 0.45)
  Top 0.406: v12.27,19.63 v12.27,26.85
  Bottom 0.406: J2.28 24.89,3.99 23.62,2.72 3.79,2.72 1.32,5.18 1.32,9.27 4.04,11.99 7.34,11.99 12.27,16.92 v12.27,19.63 | R23.1 v12.27,26.85 U1.6
ID_SD
  Bottom 0.406: J2.27 24.89,15.24 21.41,18.72 15.88,18.72 15.04,19.71 15.04,23.93 | U1.5 16.69,25.58 15.04,23.93 | 15.04,23.93 R22.1
MISO
  Bottom 0.406: U$2.12 86.87,7.37 84.58,5.08 68.33,5.08 67.06,6.35 67.06,15.11 53.34,28.83 38.82,28.83 R1.2
MOSI
  Bottom 0.406: U$2.11 88.14,7.37 85.09,4.32 67.82,4.32 66.29,5.84 66.29,14.73 53.09,27.94 42.76,27.94 R2.2
N$1
  Bottom 1.27: U4.P$3 F1.P$2 F1.P$1
N$2
  Bottom 1.27: U8.P$3 F2.P$2 F2.P$1
N$3
  Bottom 1.27: U12.P$3 F4.P$2 F4.P$1
N$4
  Bottom 1.27: U6.P$3 F3.P$2 F3.P$1
N$5
  Top 0.813: R4.2 5.05,27.42 U3.P$1
N$6
  Top 0.813: R5.2 7.66,36.93 U3.P$3
N$7
  Top 0.813: T2.P$2 11.67,36.96 R5.1 R6.2
N$8
  Top 0.813: D2.A 12.64,41.1 T2.P$1 U4.P$2
N$9
  Top 0.813: U5.P$1 R7.2
N$10
  Top 0.813: U5.P$3 53.38,36.93 R8.2
N$11
  Top 0.813: T3.P$2 57.39,36.96 R8.1 R9.2
N$12
  Top 0.813: U6.P$2 T3.P$1 58.36,41.1 D3.A
N$13
  Top 0.813: U7.P$1 R10.2
N$14
  Top 0.813: U7.P$3 32.76,36.98 R11.2
N$15
  Top 0.813: T4.P$2 34.51,39.24 R11.1 R12.2
N$16
  Top 0.813: 35.5,41.1 D4.A | 35.5,41.1 T4.P$1 | U8.P$2 T4.P$1 | T4.P$1 35.5,41.1
N$17
  Top 1.27: R14.2 103,2.92 102.11,2.03 61.47,2.03 61.21,2.29 60.58,2.92 J2.2 J2.4
N$18
  Bottom 1.27: J2.1 57.91,15.73 R15.2
N$19
  Bottom 0.406: R13.1 29.97,26.5 J2.23
N$20
  Bottom 0.406: R1.1 32.51,24.22 J2.21
N$21
  Top 0.813: U11.P$1 R16.2
N$22
  Top 0.813: R17.2 78.36,36.98 U11.P$3
N$23
  Top 0.813: T6.P$2 80.25,36.96 R17.1 R18.2
N$24
  Top 0.813: D6.A 78.03,41.16 T6.P$1 U12.P$2
N$25
  Bottom 0.406: R2.1 35.05,21.93 J2.19
N$26
  Bottom 0.406: R3.1 32.77,2.79 J2.24
N$27
  Top 0.406: Q1.3 Q1.2 Q1.1 112.87,21.7 112.62,21.95 R25.2
N$29  (via drill 0.45)
  Top 0.406: R26.2 v115.67,20.8 116.3,20.18 U2.1 | Q1.4 115.17,16.36 115.16,16.36 v115.93,15.6
  Bottom 0.406: v115.93,15.6 116.69,16.36 116.69,19.15 115.67,20.17 v115.67,20.8
N$30
  Top 0.813: U9.3 TP_ON/OFF.P$1
N$31
  Bottom 1.27: U14.P$3 F5.P$2 F5.P$1
N$32
  Bottom 1.27: U16.P$3 F6.P$2 F6.P$1
N$33
  Bottom 1.27: U20.P$3 F7.P$2 F7.P$1
N$34
  Bottom 1.27: U18.P$3 F8.P$2 F8.P$1
N$35
  Top 0.813: U13.P$1 R39.2
N$36
  Bottom 0.61: U$2.15 83.06,7.87 82.42,7.24 C11.1
  Bottom 0.813: C10.1 R19.1 | C10.1 C11.1 | U$2.16 78.92,9.45 78.44,9.93 C10.1
N$37
  Top 0.813: U13.P$3 101.34,36.98 R40.2
N$38
  Top 0.813: T5.P$2 103.11,36.96 | 103.11,36.96 R40.1 | 103.11,36.96 105.48,36.96 R41.2
N$39
  Top 0.813: D8.A 104.08,41.1 T5.P$1 U14.P$2
N$40
  Top 0.813: U15.P$1 108.71,36.98 107.34,35.61 R42.2
N$41
  Top 0.813: U15.P$3 120.8,34.44 123.34,36.98 123.8,36.98 123.82,36.98 R43.2
N$42
  Top 0.813: T7.P$2 125.97,36.96 R43.1 R44.2
N$43
  Top 0.813: D9.A 126.94,41.1 T7.P$1 U16.P$2
N$44
  Top 0.813: U17.P$1 R45.2
N$45
  Top 0.813: R46.2 167.68,36.93 U17.P$3
N$46
  Top 0.813: T8.P$2 171.69,36.96 | 171.69,36.96 R46.1 | 171.69,36.96 174.06,36.96 R47.2
N$47
  Top 0.813: D10.A 172.66,41.1 T8.P$1 U18.P$2
N$48
  Top 0.813: U19.P$1 131.17,37.09 130.39,36.31 R48.2
N$49
  Top 0.813: U19.P$3 144.22,34.54 146.66,36.98 147.07,36.98 147.1,36.94 R49.2
N$50
  Top 0.813: T9.P$2 148.83,36.96 | 148.83,36.96 R49.1 | 148.83,36.96 151.2,36.96 R50.2
N$51
  Top 0.813: D11.A 149.8,41.1 T9.P$1 U20.P$2
N$52
  pour Top (no thermals): 156.41,18.69 147.62,18.69 147.62,14.22 150.62,14.22 150.62,10.97 156.36,10.97
N$53
  Top 0.813: U9.5 124.61,10.92 TP_TRIM.P$1
N$54
  Top 0.203: F9.P$1 176.53,7.11 | 176.53,7.11 F9.P$2 | J1.1 177.6,6.04 176.53,7.11
  pour Top (no thermals): 185.93,8.89 174.88,8.89 174.24,8.26 174.24,0.51 182.37,0.51 185.93,4.83
R1
  Top 1.27: U4.P$4 CN1.5
R2
  Top 1.27: U8.P$4 CN2.5
R3
  Top 1.27: U6.P$4 CN3.5
R4
  Top 1.27: U12.P$4 CN4.5
R5
  Top 1.27: U14.P$4 CN5.5
R6
  Top 1.27: U16.P$4 CN6.5
R7
  Top 1.27: U20.P$4 CN7.5
R8
  Top 1.27: U18.P$4 CN8.5
RELAY1  (via drill 0.65)
  Top 0.813: R4.1 9.24,18.29 v55.37,18.29
  Bottom 0.813: J2.3 v55.37,18.29
RELAY2  (via drill 0.65)
  Top 0.813: R10.1 29.56,22.55 45.03,22.5 45.77,21.77 49.76,21.77 50.55,22.55 v52.81,22.55
  Bottom 0.813: v52.81,22.55 J2.5
RELAY3  (via drill 0.65)
  Top 0.813: R7.1 v47.75,23.24
  Bottom 0.813: J2.7 50.29,20.73 47.75,23.27 v47.75,23.24
RELAY4  (via drill 0.65)
  Top 0.813: 71.07,18.59 71.32,18.85 | 71.32,18.85 73.66,21.18 R16.1 | v54.61,24.69 60.4,24.69 66.24,18.85 71.32,18.85
  Bottom 0.813: v54.61,24.69 52.76,26.54 45.09,26.54 44.58,26.54 42.04,24 42.04,17.02 45.21,13.84 J2.11
RELAY5  (via drill 0.65)
  Top 0.813: R39.1 96.52,12.19 93.73,9.4 82.3,9.4 78.49,13.21 70.61,13.21 70.59,13.23 v42.67,13.23
  Bottom 0.813: J2.13 v42.67,13.23
RELAY6  (via drill 0.65)
  Top 0.813: v40.13,11 43.69,10.92 44.45,11.68 77.98,11.68 78.64,11.02 78.64,11 81.81,7.82 101.5,7.82 106.58,12.9 106.58,28.75 107.34,29.52 R42.1
  Bottom 0.813: J2.15 v40.13,11
RELAY7  (via drill 0.65, 0.85)
  Top 0.813: v70.84,8.66 73.3,6.2 102.16,6.2 108.92,12.95 v108.97,12.95 | v69.19,14.71 22.38,14.96 v22.35,14.94 | R48.1 130.41,30.98 134.31,27.08 134.31,11.99 v134.37,11.94
  Bottom 0.813: J2.29 v22.35,14.94 22.35,14.96 | v70.84,8.66 69.19,10.31 v69.19,14.71 | v108.97,12.95 119.13,12.95 121.92,10.16 132.59,10.16 v134.37,11.94
RELAY8  (via drill 0.65, 0.7, 0.85)
  Top 0.813: v62,16.59 61.98,16.61 v19.81,16.61 | v64.92,10.24 70.69,4.47 102.72,4.47 107.64,9.4 v108.97,9.4 | R45.1 145.75,27.38 136.96,18.59 136.96,9.7 v136.91,9.65
  Bottom 0.813: J2.31 v19.81,16.61 | v64.92,10.24 64.92,13.66 v62,16.59 61.98,16.61 | v108.97,9.4 109.98,10.41 118.87,10.41 121.41,7.87 135.13,7.87 v136.91,9.65
WP  (via drill 0.45)
  Top 0.406: J6.2 18.69,21.39 v13.89,21.39 13.92,21.41 v13.92,28.12
  Bottom 0.406: R21.1 v13.89,21.39 | U1.7 v13.92,28.12 | v13.92,28.12 13.89,28.12 v13.92,28.12
(copper drawn outside any net)
  shapes: Bottom circle x7, Top circle x7

### Text on the board
tPlace: Jumper to program EEPROM | 12V | GND
tNames: HOP | Designed by Diego Aguilera for Very. | Danger - Shock Hazard! | PCB v0.4